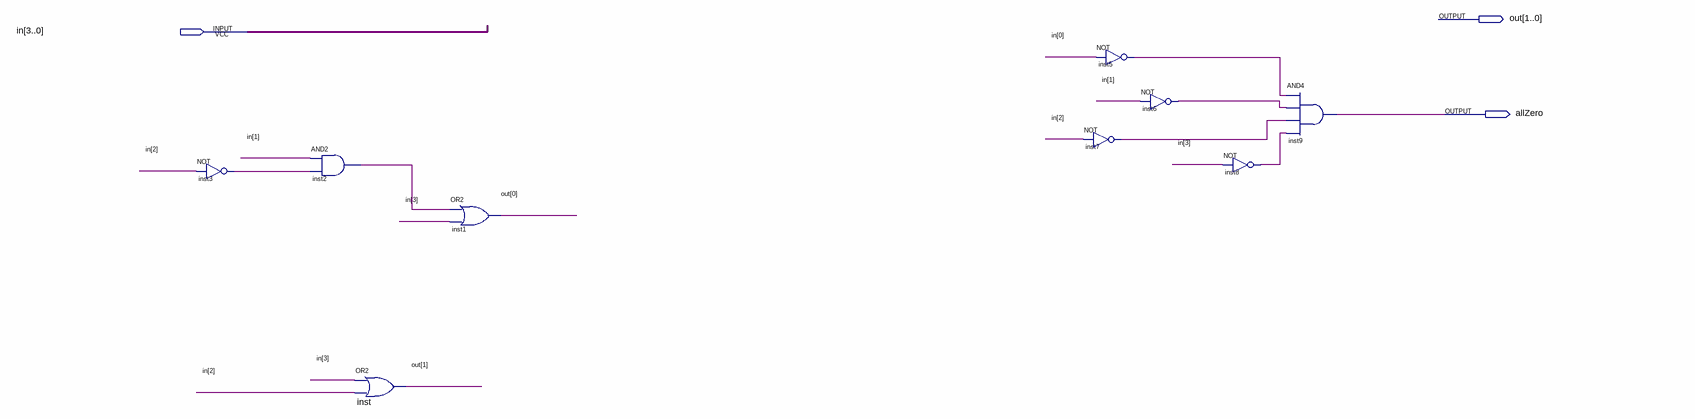
[diagram p0: schematic sheet]
// Quartus schematic priorityEncoder4to2.bdf as structural Verilog: 9 symbols, 3 pins
module priorityEncoder4to2 (
  input  [3:0] in,
  output [1:0] out,
  output allZero
);

  wire inst2_out, inst3_out, inst5_out, inst6_out, inst7_out, inst8_out;

  not inst3 (inst3_out, in[2]);
  and inst2 (inst2_out, in[1], inst3_out);
  or inst (out[1], in[3], in[2]);
  or inst1 (out[0], inst2_out, in[3]);
  not inst5 (inst5_out, in[0]);
  not inst7 (inst7_out, in[2]);
  not inst6 (inst6_out, in[1]);
  not inst8 (inst8_out, in[3]);
  and inst9 (allZero, inst5_out, inst6_out, inst7_out, inst8_out);
endmodule
